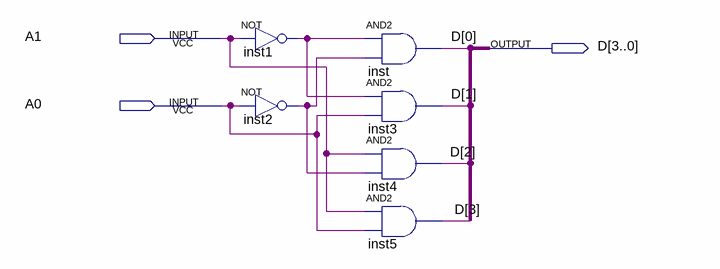
[diagram p0: schematic sheet]
// Quartus schematic DECODE2_4.bdf as structural Verilog: 6 symbols, 3 pins
module DECODE2_4 (
  input  A1,
  input  A0,
  output [3:0] D
);

  wire inst1_out, inst2_out;

  not inst1 (inst1_out, A1);
  not inst2 (inst2_out, A0);
  and inst (D[0], inst1_out, inst2_out);
  and inst3 (D[1], inst1_out, A0);
  and inst4 (D[2], A1, inst2_out);
  and inst5 (D[3], A1, A0);
endmodule
